# Altium schematic sheet MCB.SchDoc
size A3
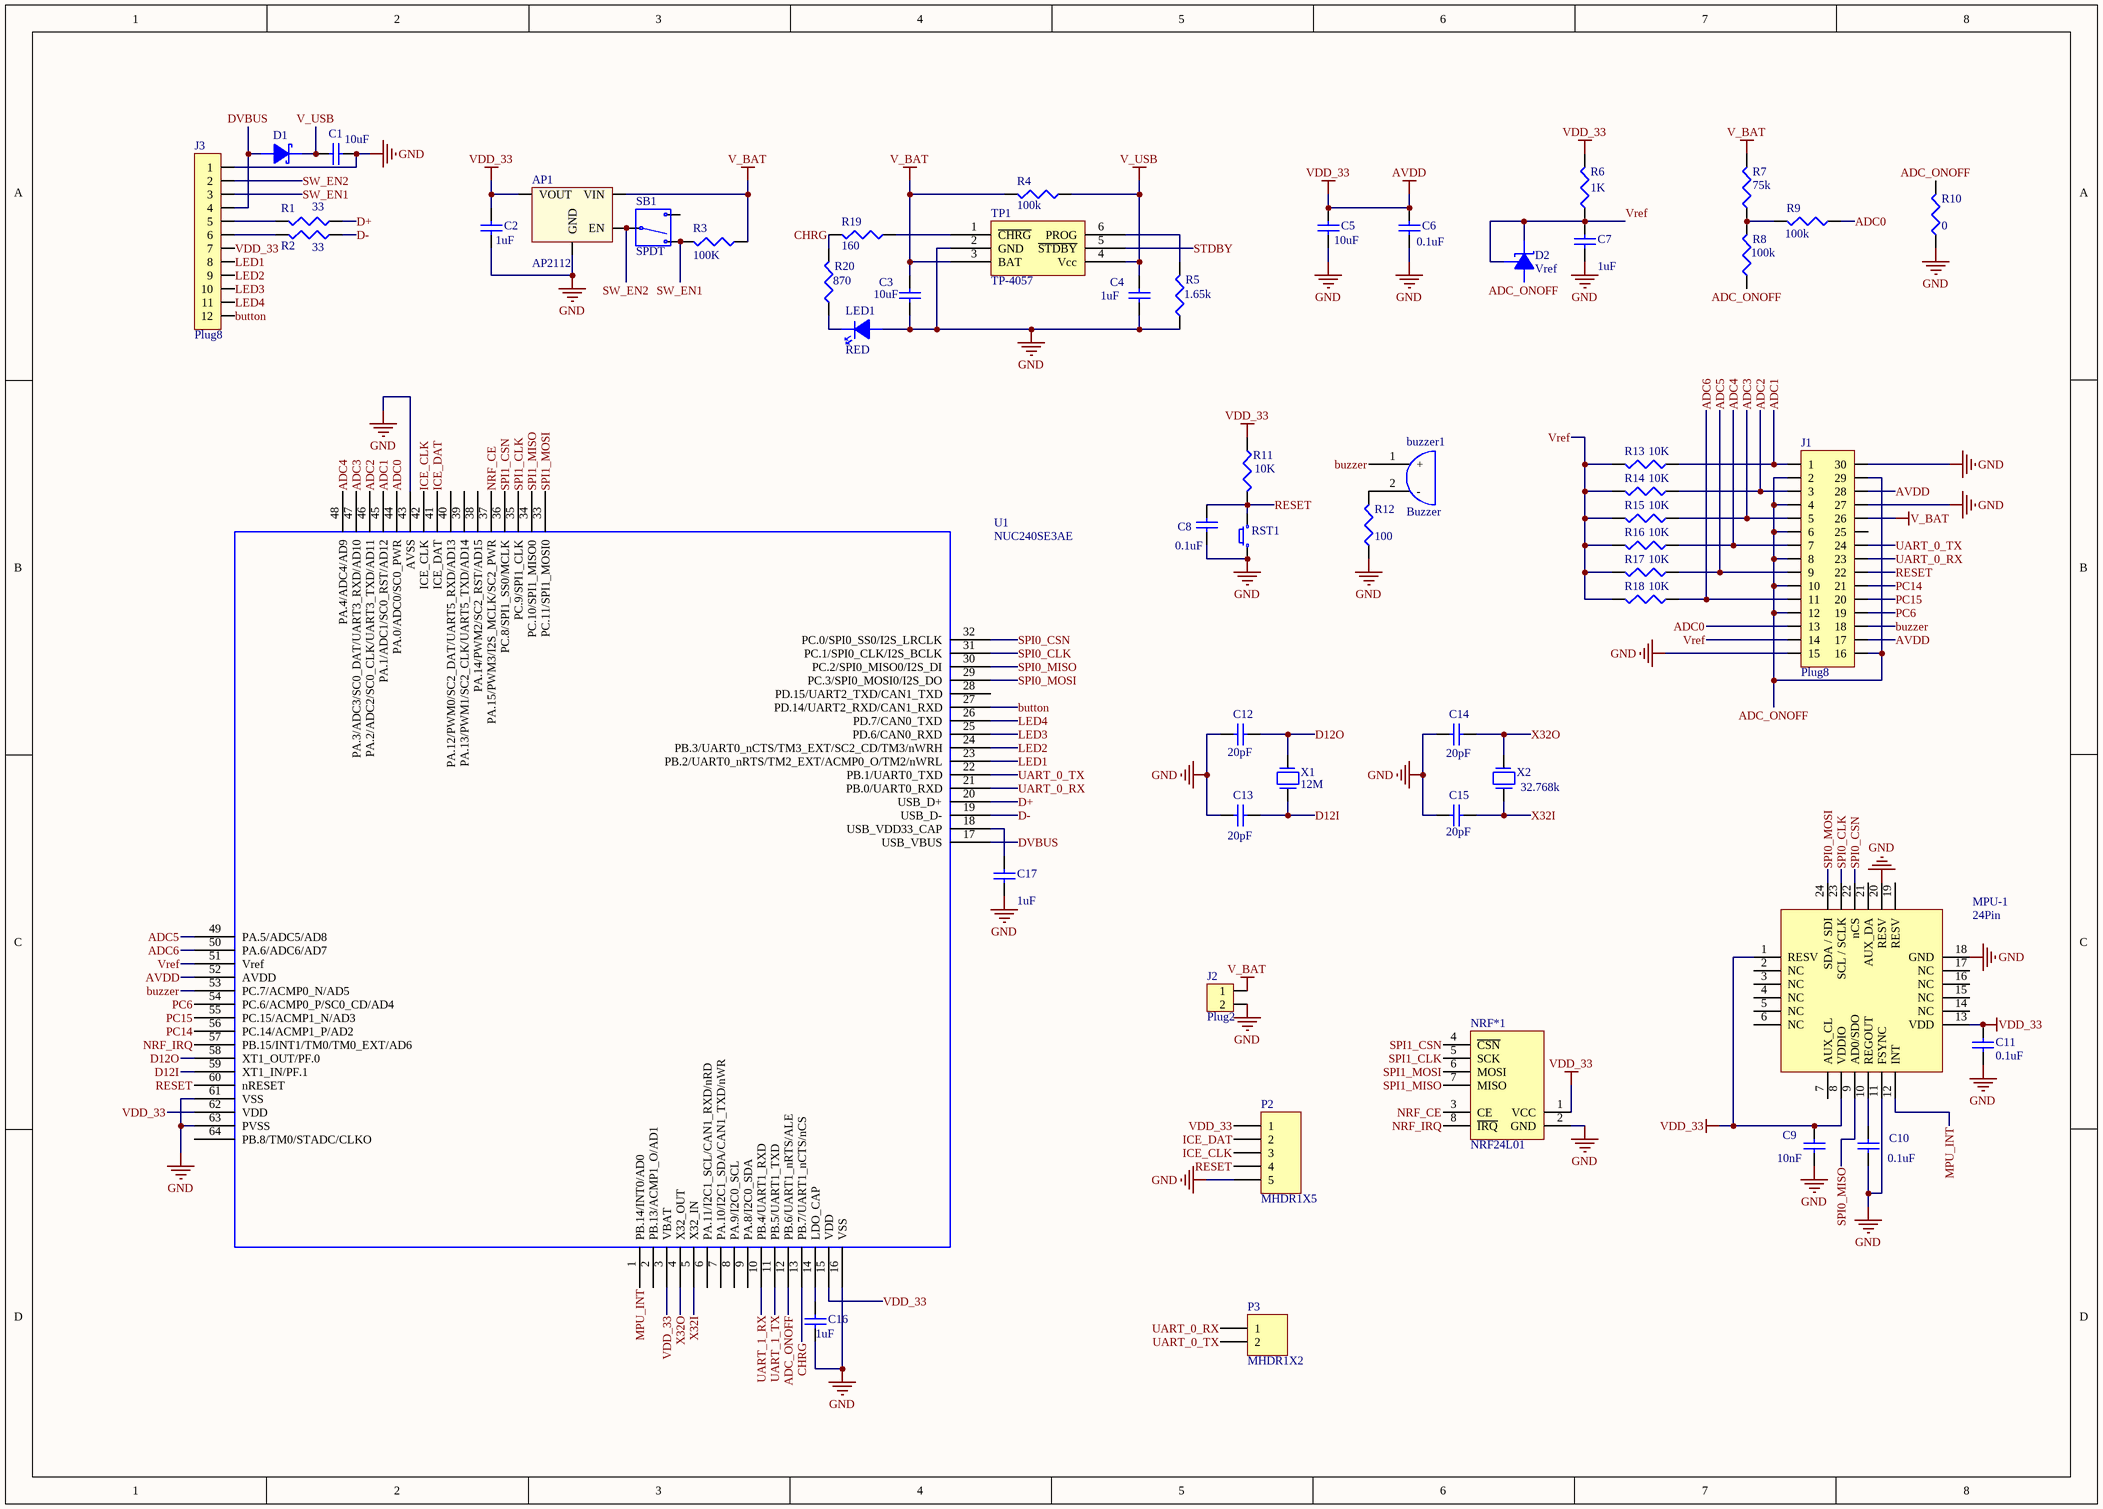
[diagram p0: MCB.SchDoc]

## Parts
AP1  AP2112  [SOT-23-5]
buzzer1  Buzzer  [HN9650B-3]
C1  value 10uF  [1608[0603]]  (hidden comment: Cap Semi)
C2  value 1uF  [1608[0603]]  (hidden comment: Cap Semi)
C3  value 10uF  [1608[0603]]  (hidden comment: Cap Semi)
C4  value 1uF  [1608[0603]]  (hidden comment: Cap Semi)
C5  value 10uF  [1608[0603]]  (hidden comment: Cap Semi)
C6  value 0.1uF  [1608[0603]]  (hidden comment: Cap Semi)
C7  value 1uF  [1608[0603]]  (hidden comment: Cap Semi)
C8  value 0.1uF  [1608[0603]]  (hidden comment: Cap Semi)
C9  value 10nF  [1608[0603]]  (hidden comment: Cap Semi)
C10  value 0.1uF  [1608[0603]]  (hidden comment: Cap Semi)
C11  value 0.1uF  [1608[0603]]  (hidden comment: Cap Semi)
C12  value 20pF  [1608[0603]]  (hidden comment: Cap Semi)
C13  value 20pF  [1608[0603]]  (hidden comment: Cap Semi)
C14  value 20pF  [1608[0603]]  (hidden comment: Cap Semi)
C15  value 20pF  [1608[0603]]  (hidden comment: Cap Semi)
C16  value 1uF  [1608[0603]]  (hidden comment: Cap Semi)
C17  value 1uF  [1608[0603]]  (hidden comment: Cap Semi)
D1  Schottky  [SOD-523]  (value not drawn)
D2  Vref  [SOT-23]
J1  Plug8  [FPC0.5-30PS]
J2  Plug2  [Terminal_block_2pin_1.25mm_SMD]
J3  Plug8  [FPC0.5-12PS]
LED1  RED  [SMD-0603_LED]
MPU-1  24Pin  [QFN_24PIN _1]
NRF*1  NRF24L01  [NRF24L01_Module_SMD]
P2  MHDR1X5  [MHDR1X5]
P3  MHDR1X2  [MHDR1X2]
R1  value 33  [J1-0603]  (hidden comment: Res3)
R2  value 33  [J1-0603]  (hidden comment: Res3)
R3  value 100K  [J1-0603]  (hidden comment: Res3)
R4  value 100k  [J1-0603]  (hidden comment: Res3)
R5  value 1.65k  [J1-0603]  (hidden comment: Res3)
R6  value 1K  [J1-0603]  (hidden comment: Res3)
R7  value 75k  [J1-0603]  (hidden comment: Res3)
R8  value 100k  [J1-0603]  (hidden comment: Res3)
R9  value 100k  [J1-0603]  (hidden comment: Res3)
R10  value 0  [J1-0603]  (hidden comment: Res3)
R11  value 10K  [J1-0603]  (hidden comment: Res3)
R12  value 100  [J1-0603]  (hidden comment: Res3)
R13  value 10K  [J1-0603]  (hidden comment: Res3)
R14  value 10K  [J1-0603]  (hidden comment: Res3)
R15  value 10K  [J1-0603]  (hidden comment: Res3)
R16  value 10K  [J1-0603]  (hidden comment: Res3)
R17  value 10K  [J1-0603]  (hidden comment: Res3)
R18  value 10K  [J1-0603]  (hidden comment: Res3)
R19  value 160  [J1-0603]  (hidden comment: Res3)
R20  value 870  [J1-0603]  (hidden comment: Res3)
RST1  SPST  [TACK-SW_SMD 2P 4x3mm_2]  (value not drawn)
SB1  SPDT  [SS-SK-02P]
TP1  TP-4057  [SOT-23-6]
U1  NUC240SE3AE  [MCU_LQFP_64_7x7]
X1  value 12M  [2520S]  (hidden comment: Xtal)
X2  value 32.768k  [FC-135]  (hidden comment: Xtal)

## Nets
AVDD: AP1.5(VOUT) C2.2 C5.2 C6.2 C9.2 C11.2 J1.17 J1.28 J3.7 MPU-1.1(RESV) MPU-1.8(VDDIO) MPU-1.13(VDD) NRF*1.1(VCC) P2.1 R6.2 R11.1 U1.3(VBAT) U1.15(VDD) U1.52(AVDD) U1.62(VDD)  [also labelled VDD_33]
GND: AP1.2(GND) C1.1 C2.1 C3.1 C4.1 C5.1 C6.1 C7.1 C8.1 C9.1 C10.1 C11.1 C12.2 C13.2 C14.2 C15.2 C16.1 C17.1 J1.15 J1.27 J1.30 J2.2 J3.1 LED1.1 MPU-1.11(FSYNC) MPU-1.18(GND) MPU-1.20(RESV) NRF*1.2(GND) P2.5 R5.1 R10.1 R12.1 RST1.2 TP1.2(GND) U1.16(VSS) U1.43(AVSS) U1.61(VSS) U1.63(PVSS)
V_BAT: AP1.1(VIN) C3.2 J1.26 J2.1 R3.1 R4.2 R7.2 TP1.3(BAT)
V_USB: C1.2 C4.2 D1.2 R4.1 TP1.4(Vcc)
ADC0: J1.13 R9.1 U1.44(PA.0/ADC0/SC0_PWR)
ADC1: J1.1 R13.1 U1.45(PA.1/ADC1/SC0_RST/AD12)
ADC2: J1.3 R14.1 U1.46(PA.2/ADC2/SC0_CLK/UART3_TXD/AD11)
ADC3: J1.5 R15.1 U1.47(PA.3/ADC3/SC0_DAT/UART3_RXD/AD10)
ADC4: J1.7 R16.1 U1.48(PA.4/ADC4/AD9)
ADC5: J1.9 R17.1 U1.49(PA.5/ADC5/AD8)
ADC6: J1.11 R18.1 U1.50(PA.6/ADC6/AD7)
ADC_ONOFF: D2.3 J1.2 J1.4 J1.6 J1.8 J1.10 J1.12 J1.16 J1.29 R8.1 R10.2 U1.12(PB.6/UART1_nRTS/ALE)
button: J3.12 U1.27(PD.14/UART2_RXD/CAN1_RXD)
buzzer: buzzer1.1(+) J1.18 U1.53(PC.7/ACMP0_N/AD5)
CHRG: R19.2 R20.2 U1.13(PB.7/UART1_nCTS/nCS)
D12I: C13.1 U1.59(XT1_IN/PF.1) X1.2
D12O: C12.1 U1.58(XT1_OUT/PF.0) X1.1
D+: R1.1 U1.20(USB_D+)
D-: R2.1 U1.19(USB_D-)
DVBUS: D1.1 J3.4 U1.17(USB_VBUS)
ICE_CLK: P2.3 U1.42(ICE_CLK)
ICE_DAT: P2.2 U1.41(ICE_DAT)
LED1: J3.8 U1.23(PB.2/UART0_nRTS/TM2_EXT/ACMP0_O/TM2/nWRL)
LED2: J3.9 U1.24(PB.3/UART0_nCTS/TM3_EXT/SC2_CD/TM3/nWRH)
LED3: J3.10 U1.25(PD.6/CAN0_RXD)
LED4: J3.11 U1.26(PD.7/CAN0_TXD)
MPU_INT: MPU-1.12(INT) U1.1(PB.14/INT0/AD0)
NRF_CE: NRF*1.3(CE) U1.37(PA.15/PWM3/I2S_MCLK/SC2_PWR)
NRF_IRQ: NRF*1.8(~{IRQ}) U1.57(PB.15/INT1/TM0/TM0_EXT/AD6)
PC6: J1.19 U1.54(PC.6/ACMP0_P/SC0_CD/AD4)
PC14: J1.21 U1.56(PC.14/ACMP1_P/AD2)
PC15: J1.20 U1.55(PC.15/ACMP1_N/AD3)
RESET: C8.2 J1.22 P2.4 R11.2 RST1.1 U1.60(nRESET)
SPI0_CLK: MPU-1.23(SCL_/_SCLK) U1.31(PC.1/SPI0_CLK/I2S_BCLK)
SPI0_CSN: MPU-1.22(nCS) U1.32(PC.0/SPI0_SS0/I2S_LRCLK)
SPI0_MISO: MPU-1.9(AD0/SDO) U1.30(PC.2/SPI0_MISO0/I2S_DI)
SPI0_MOSI: MPU-1.24(SDA_/_SDI) U1.29(PC.3/SPI0_MOSI0/I2S_DO)
SPI1_CLK: NRF*1.5(SCK) U1.35(PC.9/SPI1_CLK)
SPI1_CSN: NRF*1.4(~{CSN}) U1.36(PC.8/SPI1_SS0/MCLK)
SPI1_MISO: NRF*1.7(MISO) U1.34(PC.10/SPI1_MISO0)
SPI1_MOSI: NRF*1.6(MOSI) U1.33(PC.11/SPI1_MOSI0)
STDBY: TP1.5(~{STDBY})
SW_EN1: J3.3 R3.2 SB1.3
SW_EN2: AP1.3(EN) J3.2 SB1.2
UART_0_RX: J1.23 P3.1 U1.21(PB.0/UART0_RXD)
UART_0_TX: J1.24 P3.2 U1.22(PB.1/UART0_TXD)
UART_1_RX: U1.10(PB.4/UART1_RXD)
UART_1_TX: U1.11(PB.5/UART1_TXD)
Vref: C7.2 D2.1 D2.2 J1.14 R6.1 R13.2 R14.2 R15.2 R16.2 R17.2 R18.2 U1.51(Vref)
X32I: C15.1 U1.5(X32_IN) X2.2
X32O: C14.1 U1.4(X32_OUT) X2.1
Netbuzzer1_2: buzzer1.2(-) R12.2
NetC10_2: C10.2 MPU-1.10(REGOUT)
NetC16_2: C16.2 U1.14(LDO_CAP)
NetC17_2: C17.2 U1.18(USB_VDD33_CAP)
NetJ3_5: J3.5 R1.2
NetJ3_6: J3.6 R2.2
NetLED1_2: LED1.2 R20.1
NetR5_2: R5.2 TP1.6(PROG)
NetR7_1: R7.1 R8.2 R9.2
NetR19_1: R19.1 TP1.1(~{CHRG})

Not connected (* = marked no-connect by the designer): J1 25; MPU-1 2(NC) 3(NC) 4(NC) 5(NC) 6(NC) 7(AUX_CL) 14(NC) 15(NC) 16(NC) 17(NC) 19(RESV) 21(AUX_DA); SB1 1; U1 2(PB.13/ACMP1_O/AD1) 6(PA.11/I2C1_SCL/CAN1_RXD/nRD) 7(PA.10/I2C1_SDA/CAN1_TXD/nWR) 8(PA.9/I2C0_SCL) 9(PA.8/I2C0_SDA) 28(PD.15/UART2_TXD/CAN1_TXD) 38(PA.14/PWM2/SC2_RST/AD15) 39(PA.13/PWM1/SC2_CLK/UART5_TXD/AD14) 40(PA.12/PWM0/SC2_DAT/UART5_RXD/AD13) 64(PB.8/TM0/STADC/CLKO)

## Library data of the parts
C1-C17 = Cap Semi: Capacitor (Semiconductor SIM Model); Published: 8-Jun-2000; LatestRevisionDate: 29-May-2009; LatestRevisionNote: IPC-7351 Footprint Added.; PackageReference: C1206; Publisher: Altium Limited; PackageDescription: Chip Capacitor
D1 = Diode2
J1 = Plug30
J3 = Plug12
LED1 = LED
MPU-1 = MPU-9250_2
NRF*1 = NRF24L01_module
P2 = MHDR1X5: Header, 5-Pin; LatestRevisionDate: 17-Jul-2002; LatestRevisionNote: Re-released for DXP Platform.; Publisher: Altium Limited
P3 = MHDR1X2: Header, 2-Pin; LatestRevisionDate: 17-Jul-2002; LatestRevisionNote: Re-released for DXP Platform.; Publisher: Altium Limited
R1-R20 = Res3: Resistor; Published: 8-Jun-2000; LatestRevisionDate: 29-May-2009; LatestRevisionNote: IPC-7351 Footprint Added.; PackageReference: J1-0603; Publisher: Altium Limited; PackageDescription: Chip Resistor
RST1 = Switch_Button1
SB1 = Switch_Button2
U1 = NUC240SE3AE: OriginalSymbolOrigin: (0,0)